# EAGLE board PCB-TLY-JACK-MEGA (EAGLE 6.5.0)
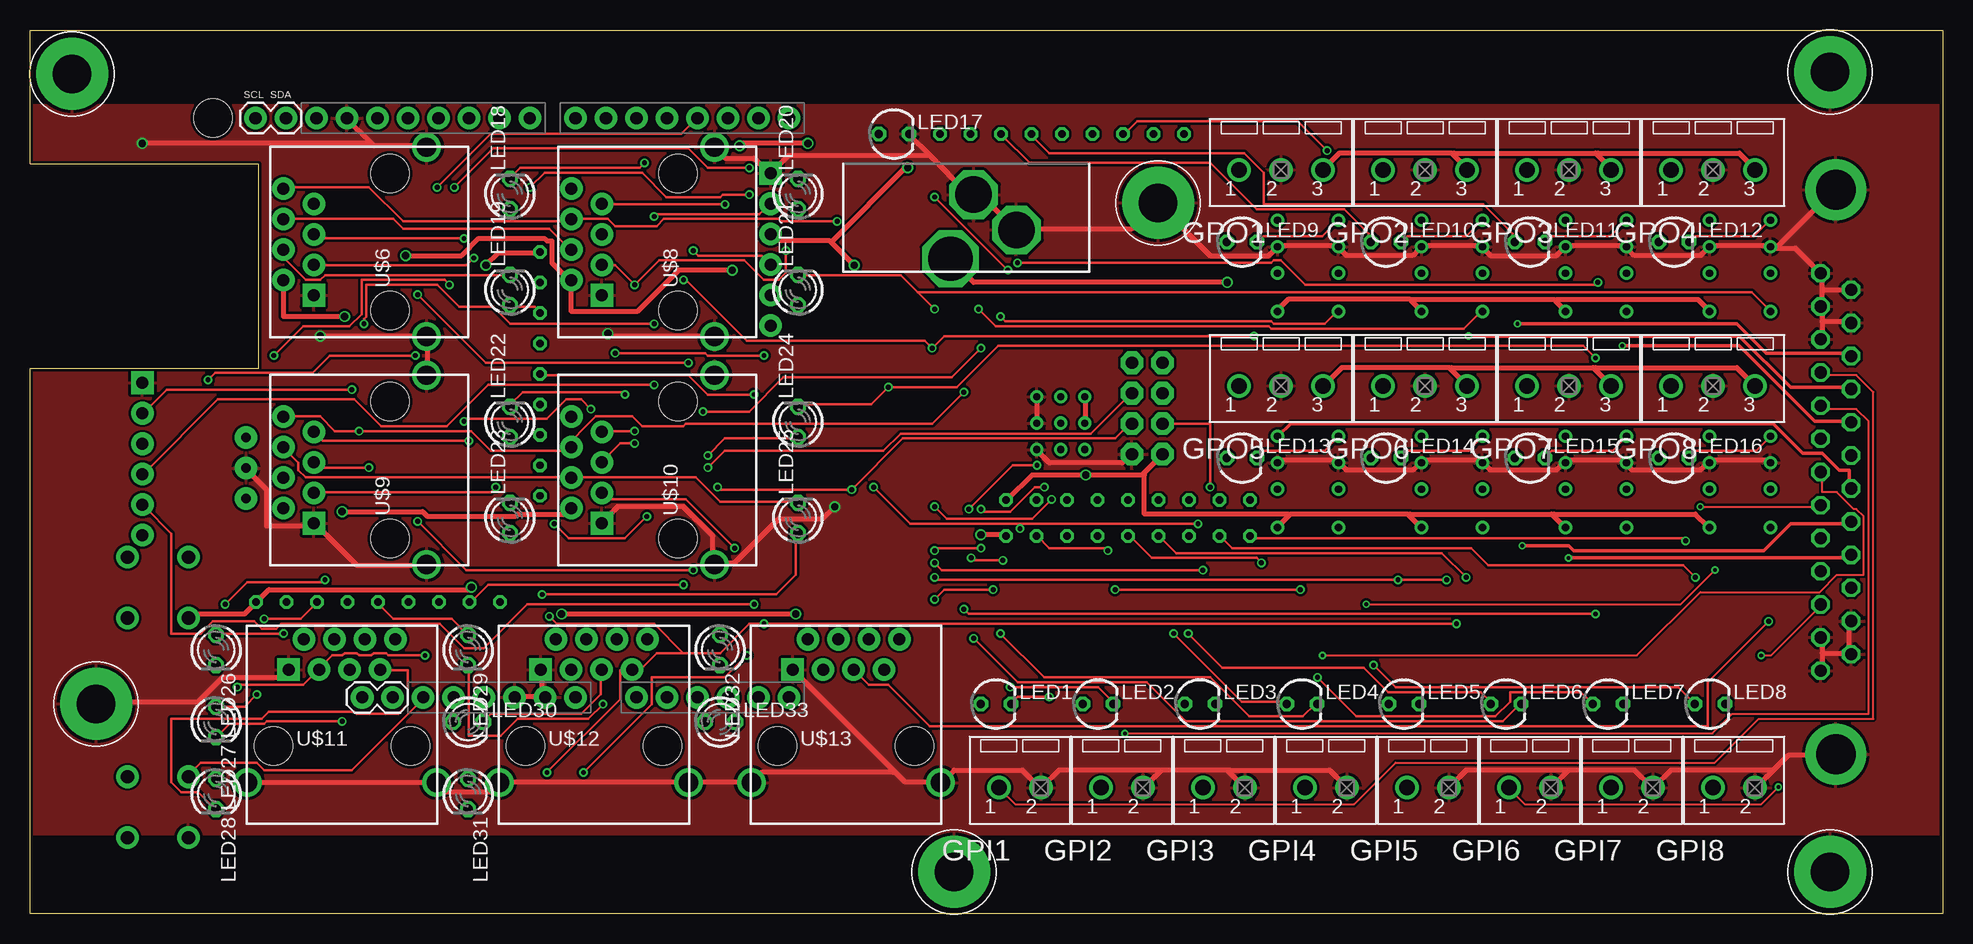
[diagram p2: board, top side]
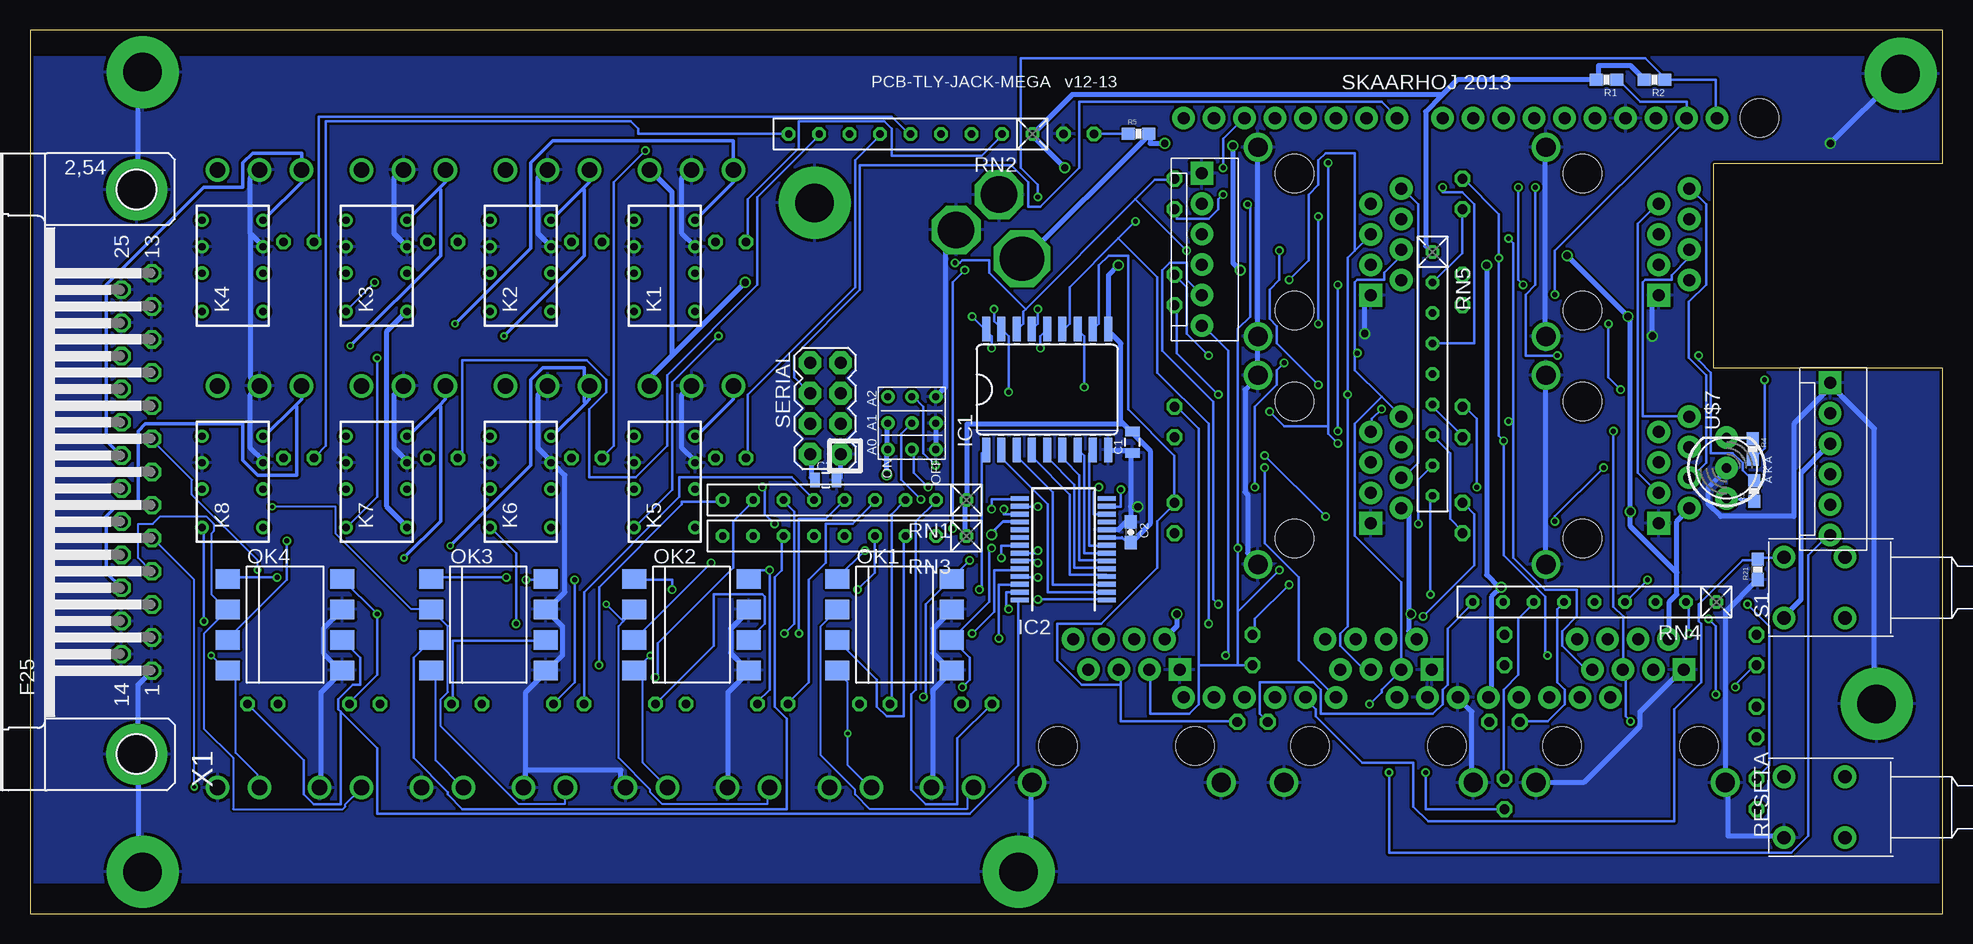
[diagram p3: board, bottom side, seen from below]

Size 159.38 x 73.66 mm. Coordinates in mm from the lower left corner, seen from the top.
Outline: 0,0 0,45.47 19.05,45.47 19.05,62.5 0,62.5 0,73.66 159.38,73.66 159.38,0 0,0
Copper layers (1*16): Top 0.035mm / dielectric 1.5mm / Bottom 0.035mm
Design rules "Fusion_eagle_rule_v1.1": minimum track width 6mil, minimum drill 12mil, track to track 6mil, track to pad 6mil, pad to pad 6mil, via to via 6mil, smd to smd 0mil, copper to edge 10mil, drill to drill 10mil, minimum pad ring 10mil, minimum via ring 6mil, stop-mask expansion 2mil, vias tented up to drill 100mil, thermal gap 10mil
Net classes: 0 default: width 0.203 mm, drill 0.406 mm, clearance 0.203 mm; 1 PWR: width 0.406 mm, drill 0.61 mm, clearance 0.203 mm; 2 RELAY LINES: width 0.305 mm, clearance 0.203 mm; 3 INput lines: clearance 0.203 mm
Holes 3.2 mm at 15.24,66.31
tRestrict: area 0,0 to 160,6.5; area 0,67.5 to 160,74
bRestrict: area 0,71.5 to 160,74; area 0,0 to 160,2.5

## Footprints (pad centres in the part's own frame; a part is rotated, then mirrored left to right if it is on the bottom)
0805 = smd 0.8 x 1.2: 1 -0.9,0; 2 0.9,0
0603-CAP = smd 1.1 x 1: 1 -0.85,0; 2 0.85,0
DUEMILANOVE_VIAS = drill 1.016 pad 1.88: 3.3V 50.8,13.97; 5V 50.8,16.51; A0 50.8,29.21; A1 50.8,31.75; A2 50.8,34.29; A3 50.8,36.83; A4 50.8,39.37; A5 50.8,41.91; AREF 2.54,2.54; D2 2.54,36.83; D3 2.54,34.29; D4 2.54,31.75; D5 2.54,29.21; D6 2.54,26.67; D7 2.54,24.13; D8 2.54,20.32; D9 2.54,17.78; D10 2.54,15.24; D11 2.54,12.7; D12 2.54,10.16; D13 2.54,7.62; GND@0 50.8,19.05; GND@1 50.8,21.59; GND@2 2.54,5.08; RES 50.8,11.43; RX 2.54,41.91; TX 2.54,39.37; VIN 50.8,24.13
MSTBV2-3.5 = drill 1.3: 1 -1.75,0.02; 2 1.75,0.02
MSTBV3-3.5 = drill 1.3: 1 -3.5,0; 2 0,0; 3 3.5,0
SO18W = smd 0.66 x 2.032: 1 -5.08,-5.029; 2 -3.81,-5.029; 3 -2.54,-5.029; 4 -1.27,-5.029; 5 0,-5.029; 6 1.27,-5.029; 7 2.54,-5.029; 8 3.81,-5.029; 9 5.08,-5.029; 10 5.08,5.029; 11 3.81,5.029; 12 2.54,5.029; 13 1.27,5.029; 14 0,5.029; 15 -1.27,5.029; 16 -2.54,5.029; 17 -3.81,5.029; 18 -5.08,5.029
SSOP28 = smd 0.4 x 1.5: 1 -4.225,-3.625; 2 -3.575,-3.625; 3 -2.925,-3.625; 4 -2.275,-3.625; 5 -1.625,-3.625; 6 -0.975,-3.625; 7 -0.325,-3.625; 8 0.325,-3.625; 9 0.975,-3.625; 10 1.625,-3.625; 11 2.275,-3.625; 12 2.925,-3.625; 13 3.575,-3.625; 14 4.225,-3.625; 15 4.225,3.625; 16 3.575,3.625; 17 2.925,3.625; 18 2.275,3.625; 19 1.625,3.625; 20 0.975,3.625; 21 0.325,3.625; 22 -0.325,3.625; 23 -0.975,3.625; 24 -1.625,3.625; 25 -2.275,3.625; 26 -2.925,3.625; 27 -3.575,3.625; 28 -4.225,3.625
1X02 = drill 1.016 pad 1.88: 1 0,0; 2 2.54,0
MOLEX-1X6 = drill 1.016 pad 1.88 square: 1 0,0 | drill 1.016 pad 1.88: 2 2.54,0; 3 5.08,0; 4 7.62,0; 5 10.16,0; 6 12.7,0
DS2Y = drill 0.6: 1 1.2,0.46; 16 1.2,5.54; O1 4.4,0.46; O2 4.4,5.54; P1 6.6,0.46; P2 6.6,5.54; S1 8.8,0.46; S2 8.8,5.54
LED3MM = drill 0.7 pad 1.2 octagon: A -1.27,0; K 1.27,0
LED3MM' = drill 0.813 octagon: A -1.27,0; K 1.27,0
DIL8-SMD = smd 1.6 x 2: 1 -3.81,-4.77; 2 -1.27,-4.77; 3 1.27,-4.77; 4 3.81,-4.77; 5 3.81,4.77; 6 1.27,4.77; 7 -1.27,4.77; 8 -3.81,4.77
0603-RES = smd 1.1 x 1: 1 -0.85,0; 2 0.85,0
PUSHBUTTON = drill 1.1 pad 1.88: 1 2.54,2.54; 2 2.54,-2.54; 3 -2.54,2.54; 4 -2.54,-2.54
RN-9 = drill 0.6 octagon: 1 -10.16,0; 2 -7.62,0; 3 -5.08,0; 4 -2.54,0; 5 0,0; 6 2.54,0; 7 5.08,0; 8 7.62,0; 9 10.16,0
2X4 = drill 1.016 pad 1.88 octagon: 1 -3.81,-1.27; 2 -3.81,1.27; 3 -1.27,-1.27; 4 -1.27,1.27; 5 1.27,-1.27; 6 1.27,1.27; 7 3.81,-1.27; 8 3.81,1.27
3.2MMPAD6MM = drill 3.2 pad 6: P$1 0,0
POWER_JACK_PTH_UPRIGHT = drill 3.048 octagon: GND -1,-4.2; SHUNT 1.935,-0.63 | drill 3.7 octagon: PWR -3.4,1.3
RJ45-8_GND_UPRIGHT = drill 1 pad 1.88 square: 1 -4.445,6.35 | drill 1 pad 1.88: 2 -3.175,8.89; 3 -1.905,6.35; 4 -0.635,8.89; 5 0.635,6.35; 6 1.905,8.89; 7 3.175,6.35; 8 4.445,8.89 | drill 1.6: GND -7.88,-3.05; GND1 7.88,-3.05 | hole 3.2: -5.715,0; 5.715,0
LED5MM-BICOLOR = drill 0.813 pad 1.88: A2 2.54,0; A3 -2.54,0; K1 0,0
3BITADDR = drill 0.6: A0 -2.2,0; A1 0,0; A2 2.2,0; H1 -2.2,2; H2 0,2; H3 2.2,2; L1 -2.2,-2; L2 0,-2; L3 2.2,-2
F25HP = drill 1.016 octagon: 1 -16.561,-1.27; 2 -13.792,-1.27; 3 -11.049,-1.27; 4 -8.28,-1.27; 5 -5.512,-1.27; 6 -2.769,-1.27; 7 0,-1.27; 8 2.769,-1.27; 9 5.512,-1.27; 10 8.28,-1.27; 11 11.049,-1.27; 12 13.792,-1.27; 13 16.561,-1.27; 14 -15.189,1.27; 15 -12.421,1.27; 16 -9.652,1.27; 17 -6.909,1.27; 18 -4.14,1.27; 19 -1.372,1.27; 20 1.372,1.27; 21 4.14,1.27; 22 6.909,1.27; 23 9.652,1.27; 24 12.421,1.27; 25 15.189,1.27 | drill 3.302 pad 5.08: G1 -23.52,0; G2 23.52,0

## Placement (x,y rotation side)
C1  100nF  [0805]  67.52,39.31 90 bottom
C2  100nF  [0603-CAP]  67.65,31.81 270 bottom
C3  10uF  [0805]  93.07,36.16 0 bottom
GND  ARDUINO_SHIELDNO_SILK  [DUEMILANOVE_VIAS]  21.34,68.85 270 top
GPI1  MSTBV23.5MM  [MSTBV2-3.5]  82.5,10.5 0 top
GPI2  MSTBV23.5MM  [MSTBV2-3.5]  91,10.5 0 top
GPI3  MSTBV23.5MM  [MSTBV2-3.5]  99.5,10.5 0 top
GPI4  MSTBV23.5MM  [MSTBV2-3.5]  108,10.5 0 top
GPI5  MSTBV23.5MM  [MSTBV2-3.5]  116.5,10.5 0 top
GPI6  MSTBV23.5MM  [MSTBV2-3.5]  125,10.5 0 top
GPI7  MSTBV23.5MM  [MSTBV2-3.5]  133.5,10.5 0 top
GPI8  MSTBV23.5MM  [MSTBV2-3.5]  142,10.5 0 top
GPO1  CON1  [MSTBV3-3.5]  104.25,62 0 top
GPO2  CON1  [MSTBV3-3.5]  116.25,62 0 top
GPO3  CON1  [MSTBV3-3.5]  128.25,62 0 top
GPO4  CON1  [MSTBV3-3.5]  140.25,62 0 top
GPO5  CON1  [MSTBV3-3.5]  104.25,44 0 top
GPO6  CON1  [MSTBV3-3.5]  116.25,44 0 top
GPO7  CON1  [MSTBV3-3.5]  128.25,44 0 top
GPO8  CON1  [MSTBV3-3.5]  140.25,44 0 top
IC1  ULN2803A  [SO18W]  74.62,43.7 0 bottom
IC2  MCP23017SS  [SSOP28]  73.27,30.39 90 bottom
JP1  [1X02]  27.69,18.05 0 top
JP3  [MOLEX-1X6]  61.72,61.72 270 bottom
JP4  [1X02]  21.34,66.31 180 top
JP5  [MOLEX-1X6]  9.36,44.26 270 bottom
K1  RELAY5VIM03  [DS2Y]  103.5,49 90 bottom
K2  RELAY5VIM03  [DS2Y]  115.5,49 90 bottom
K3  RELAY5VIM03  [DS2Y]  127.5,49 90 bottom
K4  RELAY5VIM03  [DS2Y]  139.5,49 90 bottom
K5  RELAY5VIM03  [DS2Y]  103.5,31 90 bottom
K6  RELAY5VIM03  [DS2Y]  115.5,31 90 bottom
K7  RELAY5VIM03  [DS2Y]  127.5,31 90 bottom
K8  RELAY5VIM03  [DS2Y]  139.5,31 90 bottom
LED1  3mm LED  [LED3MM]  80.5,17.5 0 top
LED2  3mm LED  [LED3MM]  89,17.5 0 top
LED3  3mm LED  [LED3MM]  97.5,17.5 0 top
LED4  3mm LED  [LED3MM]  106,17.5 0 top
LED5  3mm LED  [LED3MM]  114.5,17.5 0 top
LED6  3mm LED  [LED3MM]  123,17.5 0 top
LED7  3mm LED  [LED3MM]  131.5,17.5 0 top
LED8  3mm LED  [LED3MM]  140,17.5 0 top
LED9  3mm LED  [LED3MM]  101,56 0 top
LED10  3mm LED  [LED3MM]  113,56 0 top
LED11  3mm LED  [LED3MM]  125,56 0 top
LED12  3mm LED  [LED3MM]  137,56 0 top
LED13  3mm LED  [LED3MM]  101,38 0 top
LED14  3mm LED  [LED3MM]  113,38 0 top
LED15  3mm LED  [LED3MM]  125,38 0 top
LED16  3mm LED  [LED3MM]  137,38 0 top
LED17  3mm LED  [LED3MM]  72,65 0 top
LED18  [LED3MM']  40,60 90 top
LED19  [LED3MM']  40,52 90 top
LED20  [LED3MM']  64,60 90 top
LED21  [LED3MM']  64,52 90 top
LED22  [LED3MM']  40,41 90 top
LED23  [LED3MM']  40,33 90 top
LED24  [LED3MM']  64,41 90 top
LED25  [LED3MM']  64,33 90 top
LED26  [LED3MM']  15.5,22 270 top
LED27  [LED3MM']  15.5,16 270 top
LED28  [LED3MM']  15.5,10 270 top
LED29  [LED3MM']  36.5,22 270 top
LED30  [LED3MM']  36.5,16 0 top
LED31  [LED3MM']  36.5,10 270 top
LED32  [LED3MM']  57.5,22 270 top
LED33  [LED3MM']  57.5,16 0 top
OK1  LTV826S  [DIL8-SMD]  87.33,24.1 270 bottom
OK2  LTV826S  [DIL8-SMD]  104.26,24.1 270 bottom
OK3  LTV826S  [DIL8-SMD]  121.19,24.1 270 bottom
OK4  LTV826S  [DIL8-SMD]  138.12,24.1 270 bottom
R1  1K5  [0603-RES]  28,69.5 180 bottom
R2  1K5  [0603-RES]  24,69.5 180 bottom
R3  270  [0603-RES]  15.71,35.24 90 bottom
R4  270  [0603-RES]  15.83,38.76 270 bottom
R5  [0603-RES]  67,65 0 bottom
R21  10K  [0603-RES]  15.41,28.72 90 bottom
RESETA  [PUSHBUTTON]  10.67,8.89 90 bottom
RN1  [RN-9]  91.5,34.5 180 bottom
RN2  [RN-9]  86,65 180 bottom
RN3  [RN-9]  91.5,31.5 180 bottom
RN4  [RN-9]  29,26 180 bottom
RN5  [RN-9]  42.5,45 270 bottom
S1  [PUSHBUTTON]  10.67,27.19 90 bottom
SERIAL  M04X2  [2X4]  93.1,42.12 90 bottom
U$4  GNDPAD6MM  [3.2MMPAD6MM]  94,59.25 0 top
U$5  POWER_JACKPTH_UPRIGHT  [POWER_JACK_PTH_UPRIGHT]  78,58 90 top
U$6  Tally 1-2-3  [RJ45-8_GND_UPRIGHT]  30,56 90 top
U$7  LEDBICOLOR-AKA  [LED5MM-BICOLOR]  18,37.16 90 bottom
U$8  Tally 2-3-4  [RJ45-8_GND_UPRIGHT]  54,56 90 top
U$9  Tally 3-4-1  [RJ45-8_GND_UPRIGHT]  30,37 90 top
U$10  Tally 4-1-2  [RJ45-8_GND_UPRIGHT]  54,37 90 top
U$11  Tally 1-2-3  [RJ45-8_GND_UPRIGHT]  26,14 0 top
U$12  Tally 2-3-4  [RJ45-8_GND_UPRIGHT]  47,14 0 top
U$13  Tally 3-4-1  [RJ45-8_GND_UPRIGHT]  68,14 0 top
U$15  GNDPAD6MM  [3.2MMPAD6MM]  150,3.5 0 top
U$18  GNDPAD6MM  [3.2MMPAD6MM]  150,70.16 0 top
U$19  3BITADDR  [3BITADDR]  85.89,40.9 90 bottom
U$20  GNDPAD6MM  [3.2MMPAD6MM]  5.5,17.5 0 top
U$21  GNDPAD6MM  [3.2MMPAD6MM]  3.5,70 0 top
U$23  GNDPAD6MM  [3.2MMPAD6MM]  77,3.5 0 top
X1  DB25F  [F25HP]  150.49,36.83 90 bottom

## Tracks (layer width: path | path; a pad name or v marks a point on that pad's centre or on a via)
5V  (via drill 0.61)
  Top 0.406: 115.11,51.1 115.82,50.39 K2.1 | 115.11,51.1 115.01,51.21 104.85,51.21 104.04,50.39 K1.1 | 127.1,51.1 127,51.21 115.21,51.21 115.11,51.1 | 127.1,51.1 127.81,50.39 K3.1 | K4.1 139.8,50.39 138.99,51.21 127.2,51.21 127.1,51.1 | v68.68,54.05 66.75,55.98 | 66.75,55.98 66.65,56.08 62.18,56.08 61.77,56.49 JP3.3 | U$19.H3 87.99,43.08 87.99,41.05 U$19.H2 | 92.76,36.68 94.28,38.2 SERIAL.2 | 92.76,36.68 92.66,36.58 v87.99,36.58 83.52,36.58 81.48,34.54 RN1.1 | 104.95,33.22 105.05,33.33 114.81,33.33 114.91,33.22 | 104.95,33.22 104.04,32.31 K5.1 | 114.91,33.22 115.82,32.31 K6.1 | 126.9,33.22 126.8,33.33 115.01,33.33 114.91,33.22 | 126.9,33.22 127.81,32.31 K7.1 | K8.1 139.8,32.31 138.79,33.33 127,33.33 126.9,33.22 | 92.76,36.68 92.86,36.58 92.86,33.33 104.85,33.33 104.95,33.22 | S1.3 13.21,24.79 13.41,24.99 17.88,24.99 18.69,25.81 RN4.1 18.9,26.01 19.91,27.03 36.58,27.03 v36.78,27.23 | v38,54.05 39.01,55.07 42.47,55.07 RN5.1 | 66.75,55.98 72.95,62.18 v73.15,62.18 | v79.25,31.6 81.28,31.6 RN3.1
  Bottom 0.254: IC2.9 68.36,31.36 68,31 67.69,31 C2.2 | IC2.18 78.33,32.66 79,32 79,31.6 79,31.5
  Bottom 0.406: C2.2 67.46,31.09 66.04,32.51 66.04,38.61 67.46,40.03 C1.2 67.67,40.23 68.38,40.95 | 68.38,40.95 68.48,41.05 68.48,47.55 69.49,48.56 IC1.10 69.49,48.77 69.49,53.24 v68.68,54.05 | U$19.H2 87.99,40.84 87.99,38.81 U$19.H1 87.99,38.61 v87.99,36.58 | RN3.1 81.48,31.7 81.48,34.34 RN1.1 81.28,34.54 81.28,40.84 68.48,40.84 68.38,40.95 | C3.1 94.08,36.17 94.28,36.37 94.28,38.2 SERIAL.2 | K3.1 128.02,50.19 129.64,48.56 129.64,33.93 128.02,32.31 K7.1 | GND.5V 37.8,18.09 37.59,18.29 37.59,26.42 v36.78,27.23 36.98,27.23 38,28.25 v38,54.05 | JP5.3 9.55,39.01 11.79,36.78 11.79,26.21 13.21,24.79 S1.3 | R2.2 24.99,69.7 26.01,70.71 28.65,70.71 28.65,69.7 R1.2 40.44,69.49 41.76,68.17 | 41.76,68.17 43.08,66.85 43.08,55.68 42.67,55.27 RN5.1 | 41.76,68.17 41.86,68.28 72.54,68.28 75.79,65.02 RN2.1 75.79,64.82 v73.15,62.18 | v79.25,31.6 79,31.6
12V  (via drill 0.61)
  Top 0.406: v44.3,24.99 v63.8,24.99 | v26.21,49.78 21.13,49.78 21.13,52.63 U$6.2 | v31.29,54.86 35.97,54.86 37.39,56.29 42.88,56.29 43.08,56.08 43.48,56.08 43.48,54.25 44.91,52.83 U$8.2 45.11,52.63 45.11,50.19 50.6,50.19 54.05,53.65 v58.52,53.65 | v26.01,33.53 32.72,33.53 33.12,33.12 40.44,33.12 40.64,33.33 44.5,33.33 44.91,33.73 U$10.2 | 118.57,63.3 119.69,62.18 GPO2.3 | 118.57,63.3 118.47,63.4 109.12,63.4 107.9,62.18 GPO1.3 | 130.56,63.3 130.45,63.4 118.67,63.4 118.57,63.3 | 130.56,63.3 131.67,62.18 GPO3.3 | GPO4.3 143.66,62.18 142.44,63.4 130.66,63.4 130.56,63.3 | 118.36,45.41 119.69,44.09 GPO6.3 | 118.36,45.41 118.26,45.52 109.32,45.52 107.9,44.09 GPO5.3 | 130.35,45.41 130.25,45.52 118.47,45.52 118.36,45.41 | 130.35,45.41 131.67,44.09 GPO7.3 | GPO8.3 143.66,44.09 142.24,45.52 130.45,45.52 130.35,45.41 | v99.77,52.63 78.64,52.63 76.81,54.46 U$5.PWR | v59.13,64.01 59.33,64.21 v64.82,64.21
  Bottom 0.406: 44.5,24.99 44.5,33.33 44.91,33.73 U$10.2 | 44.5,24.99 44.5,23.57 43.89,22.96 U$12.2 | v63.8,24.99 63.8,23.98 64.82,22.96 U$13.2 | 44.5,24.99 v44.3,24.99 | 22.15,28.45 22.15,26.62 22.76,26.01 22.76,22.96 U$11.2 | 22.15,28.45 22.15,32.72 21.13,33.73 U$9.2 | 22.15,28.45 26.01,32.31 v26.01,33.53 26.01,49.58 v26.21,49.78 v31.29,54.86 | U$5.PWR 76.61,54.46 66.24,64.82 R5.2 66.04,64.82 66.04,64.21 v64.82,64.21 | 105.77,46.63 107.7,44.7 107.7,44.09 GPO5.3 | 105.77,46.63 v99.77,52.63 | GPO1.3 107.7,61.98 105.87,60.15 105.87,46.74 105.77,46.63 | v58.52,53.65 59.13,54.25 v59.13,64.01
A0  (via drill 0.41)
  Top 0.203: v79.25,33.73 79.45,33.53 81.69,33.53 83.72,35.56 v84.53,35.56
  Bottom 0.203: v79.25,33.73 79.25,34.54 77.01,34.54 IC2.15 | v84.53,35.56 85.75,36.78 85.75,38.61 U$19.A0
A1  (via drill 0.41)
  Top 0.203: v75.39,33.93 76.4,32.92 83.52,32.92 v85.14,34.54
  Bottom 0.203: v75.39,33.93 76.81,33.93 IC2.16 | v85.14,34.54 86.77,36.17 86.77,40.03 85.95,40.84 U$19.A1
A1CFG
  Bottom 0.203: S1.1 13.21,29.67 15.24,29.67 R21.2 15.44,29.46 16.66,29.46 20.32,25.81 20.32,24.38 20.12,24.18 20.12,19.3 22.35,17.07 22.35,7.72 42.88,7.72 44.09,8.94 44.09,12.6 48.36,12.6 52.22,16.46 52.22,17.07 53.03,17.88 GND.A1
A2  (via drill 0.41)
  Top 0.203: v78.23,33.73 81.89,37.39 v83.92,37.39
  Bottom 0.203: v78.23,33.73 78.23,33.33 77.01,33.33 IC2.17 | v83.92,37.39 84.94,38.41 84.94,42.27 85.75,43.08 U$19.A2
D2  (via drill 0.41)
  Top 0.203: v20.32,46.53 22.76,48.97 26.62,48.97 27.64,49.99 27.64,52.83 34.54,52.83 v34.95,52.43 | v35.36,60.55 38.61,63.8 54.86,63.8 56.49,62.18 v59.94,62.18
  Bottom 0.203: v20.32,46.53 20.32,46.13 19.3,45.11 19.3,38.41 17.48,38.41 16.66,37.59 16.66,36.98 15.85,36.17 R3.2 | v34.95,52.43 35.36,52.83 v35.36,60.55 | v59.94,62.18 59.94,64.62 58.32,66.24 GND.D2
D3  (via drill 0.41)
  Top 0.203: v14.83,44.5 15.44,45.11 23.57,45.11 24.99,46.53 v32.11,46.53 | v33.93,60.55 38.41,65.02 54.25,65.02 55.47,66.24 GND.D3
  Bottom 0.203: v14.83,44.5 14.83,38.81 15.65,38 R4.2 | v32.11,46.53 34.75,46.53 34.75,51.61 33.93,52.43 v33.93,60.55
DISP_DATA_OUT
  Bottom 0.203: GND.D7 45.52,66.45 46.74,67.67 71.93,67.67 71.93,62.18 75.18,58.93 76.2,58.93 76.2,60.96 77.62,62.38 90.22,62.38 90.22,52.02 95.71,46.53 95.71,44.7 94.49,43.48 SERIAL.6
GND  (via drill 0.61)
  Top 0.406: K5.P1 104.04,37.8 108.92,37.8 K5.P2 109.12,37.59 109.73,36.98 115.21,36.98 115.82,37.59 K6.P1 116.03,37.8 120.9,37.8 K6.P2 121.11,37.59 121.72,36.98 127.2,36.98 127.81,37.59 K7.P1 128.02,37.8 132.89,37.8 K7.P2 133.1,37.39 133.5,36.98 139.19,36.98 139.8,37.59 K8.P1 140,37.8 144.88,37.8 K8.P2 | 149.35,49.38 149.35,50.6 X1.12 149.35,50.8 149.35,52.02 | 149.35,49.38 149.35,47.95 X1.11 | 149.35,52.02 149.35,53.24 X1.13 149.15,53.44 147.12,55.47 145.49,55.47 | 149.35,49.38 151.59,49.38 X1.24 | 149.35,52.02 X1.25 | K4.P2 144.88,55.68 140,55.68 K4.P1 139.8,55.47 139.19,54.86 133.71,54.86 133.1,55.47 K3.P2 132.89,55.68 128.02,55.68 K3.P1 127.81,55.47 127.2,54.86 121.72,54.86 121.11,55.47 K2.P2 120.9,55.68 116.03,55.68 K2.P1 115.82,55.47 115.21,54.86 109.73,54.86 109.12,55.47 K1.P2 108.92,55.68 104.04,55.68 K1.P1 103.83,55.47 103.23,54.86 98.35,54.86 94.08,59.13 U$4.P$1 93.88,59.13 91.85,57.1 82.3,57.1 U$5.GND 82.09,57.1 79.45,59.74 78.64,59.74 U$5.SHUNT 78.44,59.94 78.23,59.94 74.88,63.3 | 145.49,55.47 145.09,55.47 K4.P2 | 145.49,55.47 150.37,60.35 X1.G2 | 145.49,55.47 K4.P2 | U$19.L3 83.92,43.08 83.92,41.05 U$19.L2 | U$19.L1 83.92,38.61 84.94,37.59 91.03,37.59 91.64,38.2 SERIAL.1 | U$10.1 47.75,32.72 48.97,33.93 54.46,33.93 56.9,31.5 56.9,29.26 U$10.GND 57.1,29.26 58.73,29.26 62.38,32.92 66.04,32.92 v67.06,33.93 | v48.16,48.36 48.36,48.16 56.9,48.16 U$8.GND | U$8.GND1 57.1,63.8 57.91,62.99 60.35,62.99 61.57,61.77 JP3.1 63.2,63.2 74.78,63.2 74.88,63.3 | 74.88,63.3 73.36,64.82 LED17.K | U$7.K1 18.09,36.98 19.71,35.36 19.71,32.31 23.37,32.31 23.57,32.51 U$9.1 23.77,32.51 27.23,29.06 32.92,29.06 U$9.GND
  Top 0.406: 28.35,64.31 28.65,64.01 32.92,64.01 U$6.GND1 | 28.35,64.31 26.42,66.24 GND.GND@2 | v24.18,48.16 32.92,48.16 U$6.GND 33.12,47.95 33.12,44.91 U$9.GND1 | v9.35,64.21 28.25,64.21 28.35,64.31 | 128.12,11.89 128.22,11.99 133.71,11.99 135.13,10.57 GPI7.2 135.33,10.57 136.75,11.99 145.09,11.99 145.19,11.89 | 128.12,11.89 126.8,10.57 GPI6.2 | GPI5.2 118.26,10.57 119.69,11.99 128.02,11.99 128.12,11.89 | 149.35,21.74 149.35,22.96 X1.2 | 149.35,21.74 149.35,20.32 X1.1 | 149.35,21.74 151.59,21.74 X1.14 151.59,21.95 151.59,24.38 X1.15 | 145.19,11.89 146.51,13.21 150.37,13.21 X1.G1 | 145.19,11.89 143.87,10.57 GPI8.2 | U$11.1 21.54,20.32 20.93,19.71 16.05,19.71 14.02,17.68 5.69,17.68 U$20.P$1 | GND.GND@0 40.44,18.09 42.88,18.09 GND.GND@1 42.88,18.29 42.67,18.29 42.67,20.32 U$12.1 | U$11.GND 18.29,10.97 33.73,10.97 U$11.GND1 33.93,10.77 34.54,10.16 38.41,10.16 39.01,10.77 U$12.GND 39.22,10.97 54.86,10.97 U$12.GND1 55.07,10.97 59.94,10.97 U$13.GND 60.15,10.97 60.96,11.79 71.93,11.79 72.03,11.89 | 94.18,11.89 94.28,11.99 99.77,11.99 99.87,11.89 | 94.18,11.89 92.86,10.57 GPI2.2 | 99.87,11.89 101.19,10.57 GPI3.2 | GPI4.2 109.73,10.57 108.31,11.99 99.97,11.99 99.87,11.89 | 94.18,11.89 94.08,11.99 85.75,11.99 84.33,10.57 GPI1.2 84.12,10.57 82.7,11.99 77.01,11.99 76,10.97 U$13.GND1 75.79,10.97 72.95,10.97 72.03,11.89 | 72.03,11.89 63.6,20.32 U$13.1
  Bottom 0.406: GPO5.2 104.44,43.89 105.05,43.28 105.05,38.81 104.04,37.8 K5.P1 | GPO6.2 116.43,43.89 117.04,43.28 117.04,38.81 116.03,37.8 K6.P1 115.82,37.59 114.81,36.58 114.81,26.82 116.23,25.4 OK3.7 116.23,25.2 115.01,23.98 115.01,21.54 116.23,20.32 OK3.5 116.43,20.12 118.06,18.49 118.06,11.99 | GPO7.2 128.42,43.89 129.03,43.28 129.03,38.81 128.02,37.8 K7.P1 | K8.P1 140,37.8 141.02,38.81 141.02,43.28 140.41,43.89 GPO8.2 140.41,44.09 141.02,44.7 141.02,56.49 140.92,56.59 | GPO3.2 128.42,61.98 129.03,61.37 129.03,56.69 128.02,55.68 K3.P1 | GPO1.2 104.44,61.98 105.05,61.37 105.05,56.69 104.04,55.68 K1.P1 | GPO2.2 116.43,61.98 117.04,61.37 117.04,56.69 116.03,55.68 K2.P1 | 140.92,56.59 140,55.68 K4.P1 | 140.92,56.59 141.02,56.69 141.02,61.37 140.41,61.98 GPO4.2 | U$18.P$1 150.16,70.1 150.37,69.9 150.37,60.35 X1.G2 | U$19.L1 83.92,38.81 83.92,40.84 U$19.L2 | C3.2 92.05,36.17 91.85,36.37 91.85,38.2 SERIAL.1 | U$19.L3 83.72,43.28 83.11,43.89 83.11,56.08 82.3,56.9 U$5.GND | 67.67,33.93 67.67,38.41 C1.1 67.67,38.61 69.49,38.61 IC1.9 | 67.67,33.93 67.67,32.72 C2.1 67.87,32.72 67.97,32.72 68.68,32 69.6,32 IC2.10 | v67.06,33.93 67.67,33.93 | v48.16,48.36 48.16,51 47.75,51.41 U$8.1 | U$8.GND1 57.1,63.8 57.1,48.16 U$8.GND 57.1,47.95 57.1,44.91 U$10.GND1 57.1,44.7 58.12,43.69 58.12,35.15 57.91,34.95 57.91,30.07 57.1,29.26 U$10.GND | v24.18,48.16 24.18,51 23.77,51.41 U$6.1 | U$6.GND1 33.12,63.8 33.12,48.16 U$6.GND | U$9.GND 33.12,29.26 33.12,44.7 U$9.GND1 | v9.35,64.21 3.66,69.9 U$21.P$1 | 118.06,11.99 118.06,10.57 GPI5.2 | OK4.7 133.5,25.2 134.93,23.77 134.93,21.74 133.5,20.32 OK4.5 133.5,20.12 135.13,18.49 135.13,10.57 GPI7.2
  Bottom 0.406: X1.1 149.35,20.12 150.37,19.1 150.37,13.41 X1.G1 150.37,13.21 150.37,3.86 150.16,3.66 U$15.P$1 | U$20.P$1 5.69,17.68 5.69,40.44 9.35,44.09 JP5.1 9.35,43.89 12.39,40.84 12.39,33.12 18.49,33.12 19.51,34.14 19.51,35.56 18.09,36.98 U$7.K1 | GND.GND@0 40.23,17.88 39.22,16.87 39.22,10.97 U$12.GND | R21.1 15.44,27.84 18.09,25.2 18.09,10.97 U$11.GND 17.88,10.97 17.88,6.5 13.21,6.5 RESETA.3 | OK1.7 82.7,25.2 84.12,23.77 84.12,21.74 82.7,20.32 OK1.5 82.7,20.12 84.12,18.69 84.12,10.57 GPI1.2 | OK2.7 99.57,25.2 100.99,23.77 100.99,21.74 99.57,20.32 OK2.5 99.57,20.12 101.19,18.49 101.19,10.57 GPI3.2 | U$23.P$1 76.81,3.66 76,4.47 76,10.77 U$13.GND1 | U$11.1 21.74,20.32 25.2,16.87 25.2,15.65 29.87,10.97 33.73,10.97 U$11.GND1 | 118.06,11.99 110.13,11.99 110.13,10.77 109.93,10.57 GPI4.2
  pour Top: 0,0 159,0 159,73 0,73
  pour Bottom: 0,0 159,0 159,73 0,73
GPI1
  Top 0.152: X1.10 149.35,45.11 149.56,44.91 152.2,44.91 153.62,43.48 153.62,16.26 144.07,16.26 140.41,12.6 113.79,12.6 110.34,9.14 82.09,9.14 80.87,10.36 GPI1.1
  Bottom 0.152: OK1.2 92.25,25.2 93.47,23.98 93.47,13.21 90.63,10.36 90.63,9.96 89.41,8.74 81.28,8.74 81.28,9.96 80.87,10.36 GPI1.1
GPI2  (via drill 0.3)
  Top 0.152: v91.24,15.04 140.21,15.04 141.83,16.66 153.21,16.66 153.21,41.05 152.2,42.06 149.56,42.06 149.35,42.27 X1.9
  Bottom 0.152: OK1.4 92.05,20.12 91.24,19.3 v91.24,15.04 91.24,12.39 89.41,10.57 GPI2.1
GPI3  (via drill 0.3)
  Top 0.152: v140.41,28.65 137.57,25.81 v111.35,25.81
  Bottom 0.152: 109.93,24.38 110.34,23.98 110.34,13.01 107.7,10.36 107.7,10.16 106.68,9.14 97.94,9.14 97.94,10.36 GPI3.1 | 109.93,24.38 109.12,25.2 OK2.2 | v140.41,28.65 140.41,29.46 145.9,34.95 145.9,36.17 149.15,39.42 X1.8 | 109.93,24.38 v111.35,25.81
GPI4  (via drill 0.3)
  Top 0.152: v107.7,21.54 133.91,21.54 139.19,26.82 149.15,26.82 150.57,28.25 152.81,28.25 152.81,33.12 152.2,33.73 151.99,33.73 150.57,35.15 149.35,35.15 149.35,36.78 X1.7
  Bottom 0.152: GPI4.1 106.27,10.57 108.31,12.6 108.31,19.51 108.92,20.12 OK2.4 108.92,20.32 v107.7,21.54
GPI5  (via drill 0.3)
  Top 0.152: v139.19,33.93 149.15,33.93 X1.6
  Bottom 0.152: GPI5.1 114.81,10.36 114.81,9.14 118.67,9.14 125.17,15.65 125.17,17.88 124.56,18.49 124.56,23.98 125.78,25.2 OK3.2 125.98,25.4 127.61,25.4 133.91,31.7 133.91,33.93 v139.19,33.93
GPI6  (via drill 0.3)
  Top 0.152: v145.69,10.57 144.27,9.14 124.56,9.14 123.34,10.36 GPI6.1
  Bottom 0.152: OK3.4 125.78,20.12 125.58,19.91 125.58,12.8 123.34,10.57 GPI6.1 | v145.69,10.57 145.69,27.84 149.15,31.29 X1.5
GPI7
  Bottom 0.152: X1.4 149.35,28.65 150.37,29.67 150.37,32.51 149.15,32.51 148.54,33.12 144.68,33.12 144.07,32.51 144.07,31.9 144.27,31.7 144.27,26.62 143.05,25.4 OK4.2 143.05,25.2 144.88,23.37 144.88,15.44 142.44,13.01 142.44,8.74 133.3,8.74 133.1,8.94 133.1,9.14 131.88,10.36 GPI7.1
GPI8  (via drill 0.3)
  Top 0.152: v144.27,21.54 145.09,21.54 149.15,25.6 X1.3
  Bottom 0.152: GPI8.1 140.41,10.57 140.41,11.58 142.24,13.41 142.24,19.51 142.85,20.12 OK4.4 143.05,20.32 v144.27,21.54
GPO1  (via drill 0.3)
  Top 0.305: v123.95,49.17 142.24,49.17 144.68,46.74 151.38,46.74 151.59,46.53 X1.23
  Bottom 0.305: K1.S1 103.83,57.91 100.79,60.96 100.79,61.98 GPO1.1 100.79,62.18 100.79,64.41 115.82,64.41 117.65,62.59 117.65,55.47 v123.95,49.17
GPO2  (via drill 0.3)
  Top 0.305: v119.89,48.16 142.44,48.16 146.71,43.89 151.59,43.89 X1.22
  Bottom 0.305: 113.28,60.45 112.78,60.96 112.78,61.98 GPO2.1 | 113.28,60.45 115.82,57.91 K2.S1 | v119.89,48.16 113.18,54.86 113.18,60.35 113.28,60.45
GPO3  (via drill 0.3)
  Top 0.305: v132.69,47.35 142.44,47.35 148.74,41.05 151.59,41.05 X1.21
  Bottom 0.305: 125.27,60.45 124.77,60.96 124.77,61.98 GPO3.1 | 125.27,60.45 127.81,57.91 K3.S1 | v132.69,47.35 125.17,54.86 125.17,60.35 125.27,60.45
GPO4
  Bottom 0.305: K4.S1 139.8,57.91 136.75,60.96 136.75,61.98 GPO4.1 136.75,62.18 136.75,63.4 140.82,63.4 141.63,62.59 141.63,60.55 144.88,60.55 153.01,52.43 153.01,39.42 151.79,38.2 X1.20
GPO5
  Top 0.305: X1.19 151.59,35.56 151.59,36.98 150.77,36.98 149.35,38.41 147.73,38.41 145.29,40.84 105.05,40.84 104.04,39.83 K5.S1
  Bottom 0.305: K5.S1 103.83,39.83 100.79,42.88 100.79,43.89 GPO5.1
GPO6  (via drill 0.3)
  Top 0.305: v124.36,30.68 128.22,30.68 128.63,30.28 144.47,30.28 146.71,32.51 151.59,32.51 X1.18
  Bottom 0.305: 113.08,42.57 112.78,42.88 112.78,43.89 GPO6.1 | 113.08,42.57 115.82,39.83 K6.S1 | v124.36,30.68 117.65,37.39 117.65,44.5 116.64,45.52 113.18,45.52 113.18,42.67 113.08,42.57
GPO7  (via drill 0.3)
  Top 0.305: v128.22,29.67 151.38,29.67 151.59,29.87 X1.17
  Bottom 0.305: 125.27,42.37 124.77,42.88 124.77,43.89 GPO7.1 | 125.27,42.37 127.81,39.83 K7.S1 | v128.22,29.67 125.17,32.72 125.17,42.27 125.27,42.37
GPO8
  Bottom 0.305: 137.26,42.37 136.75,42.88 136.75,43.89 GPO8.1 | 137.26,42.37 139.8,39.83 K8.S1 | X1.16 151.79,27.23 153.01,28.45 153.01,33.12 151.79,34.34 150.37,34.34 150.37,40.23 149.76,40.84 141.63,40.84 141.63,37.8 140.41,36.58 137.16,36.58 137.16,42.27 137.26,42.37
GPOINSIDE1  (via drill 0.41)
  Top 0.203: v80.87,49.78 81.28,49.38 103.43,49.38 103.63,49.17 107.9,49.17 108.92,50.19 K1.16 | v17.27,18.9 17.48,19.1 22.76,19.1 23.98,20.32 U$11.3 24.18,20.52 25.2,21.54 26.01,21.54 26.21,21.74 27.23,21.74 27.43,21.54 28.45,21.54 28.65,21.74 29.67,21.74 29.87,21.54 v32.92,21.54 | v36.98,54.66 36.37,54.05 23.77,54.05 U$6.3 | v50.39,39.22 49.17,39.22 47.75,37.8 U$10.5 | v51.21,62.59 50.8,62.18 40.84,62.18 40.03,61.37 LED18.K | v36.58,39.42 24.38,39.42 23.77,40.03 U$9.7 | v79.25,47.14 76.81,44.7 62.79,44.7 59.94,41.86 v56.08,41.86
  Bottom 0.203: v80.87,49.78 79.86,48.77 IC1.18 79.65,48.56 79.25,48.16 v79.25,47.14 | v17.27,18.9 17.27,19.1 15.65,20.73 LED26.K | LED18.K 39.83,61.16 36.98,58.32 v36.98,54.66 36.98,39.83 v36.58,39.42 36.58,29.87 33.12,26.42 33.12,21.74 v32.92,21.54 | v50.39,39.22 51.21,40.03 51.21,40.64 | v51.21,62.59 51.21,40.64 | v56.08,41.86 54.86,40.64 51.21,40.64
GPOINSIDE2  (via drill 0.41)
  Top 0.203: v79.05,50.39 80.47,48.97 103.23,48.97 103.43,48.77 119.48,48.77 120.9,50.19 K2.16 | v26.01,16.05 19.71,16.05 19.51,15.85 16.66,15.85 15.65,14.83 LED27.K | LED19.K 39.83,53.24 24.59,53.24 24.18,52.83 22.96,52.83 21.13,54.66 21.13,55.27 U$6.4 | 44.3,38.61 38.41,38.61 36.78,40.23 v27.43,40.23 25.4,40.23 24.18,41.45 21.13,41.45 U$9.8 | 44.3,38.61 44.7,38.61 44.91,38.81 U$10.6 44.3,38.61 | v77.83,43.48 75.18,40.84 54.66,40.84 54.46,40.64 51,40.64 50.19,41.45 47.14,41.45 44.3,38.61
  Bottom 0.203: v79.05,50.39 79.05,49.38 78.44,48.77 IC1.17 78.23,48.56 77.83,48.16 v77.83,43.48 | v26.01,16.05 26.42,16.46 26.42,20.12 26.62,20.32 U$11.5 26.62,20.52 26.62,24.79 27.43,25.6 v27.43,40.23 | U$9.8 21.13,41.45 24.99,41.45 24.99,52.63 24.79,52.83 22.55,52.83 22.55,53.24 21.13,54.66 21.13,55.27 U$6.4
GPOINSIDE3  (via drill 0.41)
  Top 0.203: LED28.K 15.44,8.74 14.02,10.16 12.6,10.16 11.79,10.97 11.79,16.26 19.3,16.26 19.91,16.87 27.03,16.87 27.23,16.66 30.68,16.66 31.5,17.48 31.5,20.32 29.26,20.32 U$11.7 | v36.17,56.29 23.98,56.29 23.77,56.49 U$6.5 | v50.39,40.23 47.75,40.23 U$10.7 | U$8.3 47.75,54.05 48.77,54.05 v50.39,52.43 52.43,54.46 59.54,54.46 61.16,52.83 62.38,52.83 62.99,53.44 v62.99,55.27 | v130.66,52.63 130.45,52.43 106.27,52.43 104.24,54.46 103.63,54.46 103.43,54.25 v82.3,54.25 | v36.17,41.05 36.37,41.25 43.08,41.25 44.7,42.88 45.92,42.88 v46.74,42.06
  Bottom 0.203: v36.17,56.29 35.76,55.88 35.76,41.05 | 35.76,41.05 35.76,29.67 33.12,27.03 30.48,27.03 30.48,24.79 31.7,23.57 31.7,22.35 29.87,20.52 29.26,20.52 U$11.7 | v50.39,52.43 v50.39,40.23 | 67.26,59.54 65.63,61.16 64.01,61.16 LED20.K | 67.26,59.54 76.4,50.39 | 76.4,50.39 76.61,50.19 76.61,49.17 77.01,48.77 IC1.16 | v130.66,52.63 132.89,50.39 K3.16 | v82.3,54.25 81.89,54.25 81.69,54.46 79.45,54.46 79.45,53.44 76.4,50.39 | 67.26,59.54 v62.99,55.27 | v36.17,41.05 35.76,41.05 | v46.74,42.06 47.55,41.25 47.55,40.23 U$10.7
GPOINSIDE4  (via drill 0.41)
  Top 0.203: v47.75,17.48 46.53,16.26 40.64,16.26 39.22,14.83 36.58,14.83 36.58,20.73 LED29.K | U$6.6 21.13,57.91 30.28,57.91 31.09,57.1 43.28,57.1 44.91,55.47 U$8.4 | 73.97,51.82 72.54,53.24 64.01,53.24 LED21.K | 73.97,51.82 v75.39,50.39 | 73.97,51.82 143.46,51.82 144.88,50.39 K4.16 | v48.77,46.74 56.29,46.74 56.49,46.53 v61.16,46.53
  Bottom 0.203: v47.75,17.48 46.74,18.49 46.74,18.69 45.11,20.32 U$12.3 45.11,20.52 45.11,27.64 48.97,31.5 48.97,40.84 46.74,43.08 | 46.74,43.08 48.97,45.31 48.97,46.74 | 46.74,43.08 U$10.8 | 48.97,46.74 48.97,52.63 48.77,52.83 46.53,52.83 46.53,53.44 45.11,54.86 45.11,55.27 U$8.4 | v75.39,50.39 75.39,49.17 75.79,48.77 IC1.15 | v48.77,46.74 48.97,46.74 | v61.16,46.53 62.99,48.36 62.99,52.22 63.8,53.03 63.8,53.24 LED21.K
GPOINSIDE5  (via drill 0.41)
  Top 0.203: v102.01,48.16 76.2,48.16 v75.18,47.14 74.57,47.75 59.74,47.75 54.66,52.83 v54.46,52.83 | v38.81,35.56 38.41,35.15 23.77,35.15 U$9.3 | LED30.K 37.8,16.05 38.41,16.66 45.92,16.66 47.55,18.29 47.55,20.32 U$12.5 | v49.58,43.28 49.38,43.48 41.05,43.48 40.03,42.47 LED22.K
  Bottom 0.203: v75.18,47.14 75.18,48.16 74.78,48.56 IC1.14 | v102.01,48.16 105.87,44.3 105.87,35.36 108.92,32.31 K5.16 | v38.81,35.56 38.81,41.25 39.83,42.27 LED22.K | U$6.7 23.77,59.13 25.4,57.51 25.4,36.78 23.77,35.15 U$9.3 | 48.97,55.27 49.58,54.66 v49.58,43.28 49.58,23.98 50.19,23.37 50.19,22.35 48.36,20.52 47.75,20.52 U$12.5 | 48.97,55.27 47.75,56.49 U$8.5 | v54.46,52.83 52.83,54.46 52.83,59.94 52.02,60.76 52.02,62.79 51.41,63.4 48.97,63.4 48.97,55.27
GPOINSIDE6  (via drill 0.41)
  Top 0.203: v67.26,57.71 62.59,57.71 62.38,57.91 52.83,57.91 52.22,57.3 48.77,57.3 48.16,57.91 U$8.6 44.91,57.71 31.09,57.71 28.25,60.55 21.13,60.55 U$6.8 | v118.87,24.18 v61.16,24.18 59.94,24.18 57.51,21.74 54.46,21.74 | 54.46,21.74 52.22,21.74 51,20.52 50.19,20.52 U$12.7 49.99,20.32 49.17,20.32 49.17,17.88 v43.08,11.79 | v43.28,24.79 43.89,24.18 52.02,24.18 54.46,21.74
  Bottom 0.203: U$9.4 20.93,36.37 19.71,37.59 19.71,44.91 21.13,46.33 21.13,51 19.71,52.43 19.71,59.13 20.93,60.35 U$6.8 | v67.26,57.71 68.68,56.29 | 68.68,56.29 72.75,52.22 72.75,49.17 73.15,48.77 IC1.13 | v118.87,24.18 118.87,30.07 120.9,32.11 K6.16 | v43.08,11.79 43.08,8.74 36.58,8.74 LED31.K | v43.28,24.79 39.01,29.06 39.01,33.33 39.83,34.14 LED23.K | 68.68,56.29 65.43,53.03 65.43,45.11 61.16,40.84 v61.16,24.18
GPOINSIDE7  (via drill 0.41)
  Top 0.203: LED24.K 64.01,42.47 70.1,42.47 v71.53,43.89 77.22,43.89 80.67,47.35 129.44,47.35 v130.45,46.33 | v58.73,30.48 54.66,34.54 48.16,34.54 47.75,34.95 U$10.3 | v28.25,37.19 24.18,37.19 23.77,37.59 U$9.5 | v32.31,32.72 36.37,28.65 v55.27,28.65 | v57.91,59.13 47.75,59.13 U$8.7
  Bottom 0.203: v71.53,43.89 71.53,48.16 71.93,48.56 IC1.12 | v130.45,46.33 130.45,34.75 132.89,32.31 K7.16 | 61.98,20.73 58.73,20.73 | 58.73,20.73 LED32.K | 61.98,20.73 61.98,17.48 62.79,16.66 66.04,16.66 66.04,20.32 U$13.3 | 58.73,20.73 58.73,25.2 | 58.73,25.2 v58.73,30.48 58.73,48.77 57.71,49.78 57.71,58.93 v57.91,59.13 | v28.25,37.19 32.31,33.12 v32.31,32.72 | 58.73,25.2 v55.27,28.65 | 61.98,20.73 61.98,40.44 63.8,42.27 LED24.K
GPOINSIDE8  (via drill 0.41)
  Top 0.203: LED25.K 63.8,34.34 57.51,34.34 55.47,36.37 U$10.4 44.91,36.37 22.96,36.37 22.35,36.98 22.35,37.59 21.13,38.81 U$9.6 | v144.88,24.38 139.8,19.3 139.8,15.65 74.98,15.65 71.53,19.1 69.9,19.1 68.68,20.32 U$13.5
  Bottom 0.203: IC1.11 70.71,48.77 70.31,49.17 70.31,54.05 69.49,54.86 67.87,54.86 67.87,42.06 64.01,38.2 64.01,34.34 LED25.K 64.01,34.14 65.43,32.72 65.43,28.85 70.1,24.18 73.76,24.18 73.76,21.13 71.73,19.1 68.48,19.1 | U$8.8 44.91,60.35 43.69,59.13 43.69,37.59 44.91,36.37 U$10.4 | v144.88,24.38 144.88,32.11 K8.16 | 68.48,19.1 68.48,20.32 U$13.5 | 68.48,19.1 68.48,16.05 58.93,16.05 LED33.K
I2C_SCL  (via drill 0.41)
  Top 0.203: v70.31,35.56 73.36,32.51 82.5,32.51 | v97.33,32.51 82.5,32.51 | v98.35,35.56 98.35,40.84 94.49,40.84 SERIAL.4 | v81.48,53.65 v75.39,59.74 | 82.5,32.51 v82.5,32.11
  Bottom 0.203: JP4.2 18.9,66.45 18.9,69.49 22.96,69.49 R2.1 23.16,69.7 24.79,71.32 76.81,71.32 76.81,62.18 75.39,60.76 v75.39,59.74 | v70.31,35.56 70.71,35.15 70.71,33.33 69.7,33.33 IC2.12 | v97.33,32.51 98.15,33.33 98.15,35.36 v98.35,35.56 | v81.48,53.65 82.5,52.63 v82.5,32.11
I2C_SDA  (via drill 0.41)
  Top 0.203: SERIAL.3 91.64,40.84 90.42,39.62 72.75,39.62 v68.48,35.36 57.51,35.36 v57.3,35.56 | v32.31,51.61 38,45.92 v54.86,45.92
  Bottom 0.203: R1.1 27.03,69.49 25.2,67.67 21.34,67.67 JP4.1 21.34,66.24 32.31,55.27 v32.31,51.61 | v68.48,35.36 68.48,33.93 69.49,33.93 IC2.13 | v54.86,45.92 55.47,45.31 55.47,44.09 57.3,42.27 v57.3,35.56
IN1  (via drill 0.41)
  Top 0.203: v78.44,29.67 78.64,29.46 v81.08,29.46 | v84.94,18.09 82.3,18.09 81.89,17.68 LED1.K
  Bottom 0.203: v78.44,29.67 78.44,30.68 77.01,30.68 IC2.21 | v81.08,29.46 82.5,28.04 OK1.8 82.7,27.84 84.73,25.81 84.73,18.29 v84.94,18.09
IN2  (via drill 0.41)
  Top 0.203: v75.39,30.28 75.59,30.48 v79.25,30.48 | v81.69,18.9 89,18.9 90.22,17.68 LED2.K
  Bottom 0.203: v75.39,30.28 75.39,30.07 76.81,30.07 IC2.22 | v79.25,30.48 79.45,30.28 79.45,26.01 82.5,22.96 OK1.6 82.5,22.76 81.08,21.34 81.08,19.51 v81.69,18.9
IN3  (via drill 0.41)
  Top 0.203: v75.39,29.26 76,28.65 v97.74,28.65
  Bottom 0.203: v75.39,29.26 75.39,29.46 76.81,29.46 IC2.23 | OK2.8 99.36,28.04 99.36,28.65 v97.74,28.65 97.74,18.69 98.75,17.68 LED3.K
IN4  (via drill 0.41)
  Top 0.203: v80.87,23.37 84.53,19.71 98.35,19.71 101.6,16.46 106.07,16.46 107.09,17.48 LED4.K
  Bottom 0.203: v80.87,23.37 79.05,25.2 79.05,28.65 77.01,28.65 IC2.24 | OK2.6 99.36,22.96 98.15,24.18 98.15,26.42 98.35,26.62 102.41,26.62 102.41,22.35 107.09,17.68 LED4.K
IN5  (via drill 0.41)
  Top 0.203: v75.39,28.04 75.59,27.84 v114,27.84 v118.06,27.84
  Bottom 0.203: v75.39,28.04 76.81,28.04 IC2.25 | v118.06,27.84 116.43,27.84 OK3.8 | v114,27.84 114,19.3 115.62,17.68 LED5.K
IN6  (via drill 0.41)
  Top 0.203: v78.64,22.96 82.3,19.3 93.07,19.3 96.32,16.05 122.73,16.05 124.16,17.48 LED6.K
  Bottom 0.203: v78.64,22.96 78.64,27.43 77.01,27.43 IC2.26 | OK3.6 116.43,22.76 124.16,22.76 124.16,17.68 LED6.K
IN7  (via drill 0.41)
  Top 0.203: v77.83,25.4 78.23,24.99 v130.45,24.99
  Bottom 0.203: v77.83,25.4 78.03,25.6 78.03,26.82 77.01,26.82 IC2.27 | OK4.8 133.3,27.84 v130.45,24.99 130.45,19.91 132.69,17.68 LED7.K
IN8
  Bottom 0.203: 133.5,16.87 133.71,17.07 133.71,17.88 132.49,19.1 131.88,19.1 131.88,21.34 133.3,22.76 OK4.6 | 133.5,16.87 130.45,13.82 130.45,8.33 81.08,8.33 77.01,12.39 77.01,26.01 IC2.28 | 133.5,16.87 133.5,9.14 135.74,9.14 136.55,9.96 136.55,12.8 141.22,17.48 LED8.K
N$1
  Bottom 0.203: RN1.2 83.92,34.34 85.55,32.72 85.55,18.69 85.95,18.29 85.95,10.36 84.73,9.14 82.09,9.14 82.09,14.63 79.25,17.48 LED1.A
N$2
  Bottom 0.203: RN1.3 86.56,34.34 87.58,33.33 87.58,17.68 LED2.A
N$3  (via drill 0.41)
  Top 0.203: v52.02,44.09 38.2,44.09 34.75,40.64 29.26,40.64 27.03,42.88 15.65,42.88 9.55,36.78 JP5.4 | v55.27,55.27 55.68,54.86 60.96,54.86 JP3.4
  Bottom 0.203: v52.02,44.09 55.47,47.55 55.47,48.97 56.08,49.58 56.08,52.02 55.27,52.83 v55.27,55.27
N$4
  Bottom 0.203: RN5.2 42.47,52.63 40.03,55.07 40.03,58.73 LED18.A
N$5  (via drill 0.41)
  Top 0.203: v75.39,26.21 76.2,27.03 v80.26,27.03
  Bottom 0.203: v75.39,26.21 69.7,26.21 IC2.1 | v80.26,27.03 80.06,27.23 80.06,38.41 79.86,38.61 IC1.1
N$6
  Bottom 0.203: RN1.4 89,34.34 90.83,32.51 93.07,32.51 93.07,29.26 94.49,27.84 94.49,19.3 96.11,17.68 LED3.A
N$7
  Bottom 0.203: R4.1 15.85,39.62 17.88,39.62 U$7.A2
N$8  (via drill 0.41)
  Top 0.203: v60.35,25.81 41.45,25.81 37.8,22.15 36.17,22.15 34.14,24.18 20.93,24.18 20.52,23.77 19.3,23.77 18.69,24.38 15.24,24.38 14.22,23.37 11.79,23.37 11.79,31.7 9.55,33.93 JP5.5
  Bottom 0.203: v60.35,25.81 60.76,26.21 60.76,42.67 65.02,46.94 65.02,53.65 64.41,54.25 62.99,54.25 62.99,52.83 JP3.5
N$9
  Top 0.203: RN5.3 42.47,50.19 42.06,50.6 40.03,50.6 LED19.A
N$10  (via drill 0.41)
  Top 0.203: v95.3,23.37 100.99,17.68 104.65,17.68 LED4.A
  Bottom 0.203: v95.3,23.37 95.3,32.92 93.07,32.92 91.64,34.34 RN1.5
N$11
  Bottom 0.203: R3.1 15.85,34.54 17.88,34.54 U$7.A3
N$12  (via drill 0.41)
  Top 0.203: v26.82,43.69 11.38,43.69 9.55,41.86 JP5.2 | v27.84,49.17 27.84,49.58 28.04,49.78 28.04,52.43 33.93,52.43 35.76,50.6 38.61,50.6 40.03,49.17 v52.02,49.17 | v52.02,58.12 52.22,58.32 60.76,58.32 61.57,59.13 JP3.2
  Bottom 0.203: v26.82,43.69 27.84,44.7 v27.84,49.17 | v52.02,58.12 v52.02,49.17
N$13  (via drill 0.41)
  Top 0.203: v41.66,60.55 42.88,61.77 51,61.77 53.03,59.74 57.51,59.74 57.71,59.94 v59.94,59.94
  Bottom 0.203: v41.66,60.55 41.66,60.15 40.03,60.15 39.01,59.13 39.01,47.55 42.47,47.55 RN5.4 | v59.94,59.94 60.35,59.54 60.35,58.73 61.16,57.91 63.8,57.91 63.8,58.73 LED20.A
N$14
  Bottom 0.203: RN1.6 94.08,34.54 95.91,36.37 105.26,36.37 105.26,34.75 113.18,26.82 113.18,17.68 LED5.A
N$15  (via drill 0.41)
  Top 0.203: v96.52,23.37 99.36,20.52 111.15,20.52 113.18,18.49 120.9,18.49 121.72,17.68 LED6.A
  Bottom 0.203: v96.52,23.37 95.71,24.18 95.71,33.53 96.52,34.34 RN1.7
N$16  (via drill 0.41)
  Top 0.203: v107.29,19.71 110.54,16.46 122.12,16.46 123.34,17.68 123.34,18.49 129.24,18.49 130.05,17.68 LED7.A
  Bottom 0.203: v107.29,19.71 107.09,19.91 107.09,22.55 100.79,28.85 100.79,32.72 99.16,34.34 RN1.8
N$17  (via drill 0.41)
  Top 0.203: v60.35,43.28 56.49,43.28 54.86,44.91 42.67,44.91 RN5.5
  Bottom 0.203: v60.35,43.28 63.8,46.74 63.8,50.6 LED21.A
N$18  (via drill 0.41)
  Top 0.203: v111.96,20.73 113.79,18.9 137.36,18.9 138.58,17.68 LED8.A
  Bottom 0.203: v111.96,20.73 111.96,27.23 105.05,34.14 105.05,34.34 101.8,34.34 RN1.9
N$19
  Bottom 0.203: RN2.2 78.44,64.82 80.06,63.2 87.58,63.2 87.58,65.43 88.19,66.04 95.3,66.04 95.3,63.8 99.57,59.54 99.57,56.08 LED9.A
N$20
  Top 0.203: RN2.3 81.08,64.82 83.31,62.59 98.35,62.59 102.21,58.73 109.53,58.73 111.56,56.69 111.56,56.08 LED10.A
N$21
  Bottom 0.203: RN5.6 42.47,42.27 40.03,39.83 LED22.A
N$22
  Top 0.203: RN2.4 83.52,64.82 84.94,63.4 101.19,63.4 102.82,61.77 102.82,59.13 121.11,59.13 123.55,56.69 123.55,56.08 LED11.A
N$23
  Bottom 0.203: RN2.5 86.16,65.02 87.58,66.45 135.33,66.45 135.33,56.29 135.53,56.08 LED12.A
N$24
  Bottom 0.203: RN2.6 88.59,64.82 90.63,62.79 90.63,52.22 99.57,43.28 99.57,38.2 LED13.A
N$25
  Bottom 0.203: RN5.7 42.47,39.83 41.05,38.41 41.05,32.92 40.03,31.9 LED23.A
N$26  (via drill 0.41)
  Top 0.203: v108.1,63.6 105.66,66.04 92.25,66.04 91.24,65.02 RN2.7
  Bottom 0.203: v108.1,63.6 110.74,60.96 110.74,39.01 111.56,38.2 LED14.A
N$27
  Bottom 0.203: RN2.8 93.67,64.82 98.75,59.74 98.75,52.43 106.27,44.91 106.27,39.01 108.92,36.37 112.78,36.37 112.78,42.06 111.35,43.48 111.35,44.5 112.98,46.13 123.34,46.13 123.34,38.41 123.55,38.2 LED15.A
N$28
  Bottom 0.203: RN2.9 96.32,65.02 108.71,65.02 108.71,65.43 109.32,66.04 134.72,66.04 134.72,39.01 135.53,38.2 LED16.A
N$29  (via drill 0.41)
  Top 0.203: v43.69,32.51 44.91,31.29 49.58,31.29 v51.41,33.12 | v56.49,38.2 57.91,39.62 63.8,39.62 LED24.A
  Bottom 0.203: v43.69,32.51 43.69,36.17 42.67,37.19 RN5.8 | v56.49,38.2 v51.41,33.12
N$30
  Bottom 0.203: R5.1 67.87,65.02 70.71,65.02 LED17.A
N$31  (via drill 0.41)
  Top 0.203: v42.67,26.62 62.18,26.62 63.8,28.25 63.8,31.7 LED25.A
  Bottom 0.203: v42.67,26.62 42.67,34.75 RN5.9
N$32  (via drill 0.41)
  Top 0.203: v21.13,23.37 15.65,23.37 LED26.A
  Bottom 0.203: v21.13,23.37 21.13,25.6 21.34,25.81 RN4.2
N$33  (via drill 0.41)
  Top 0.203: v19.51,24.59 22.55,24.59 23.77,25.81 RN4.3 | v18.9,18.29 17.88,17.27 15.65,17.27 LED27.A
  Bottom 0.203: v19.51,24.59 18.9,23.98 v18.9,18.29
N$34
  Bottom 0.203: IC2.2 69.7,26.82 74.57,26.82 74.57,34.14 78.23,37.8 78.23,38.61 IC1.2
N$35
  Bottom 0.203: IC2.3 69.7,27.43 74.17,27.43 74.17,35.15 77.01,38 77.01,38.61 IC1.3
N$36
  Bottom 0.203: IC2.4 69.7,28.25 72.75,28.25 72.75,34.95 75.79,38 75.79,38.61 IC1.4
N$37
  Bottom 0.203: IC2.5 69.7,28.85 72.34,28.85 72.34,35.76 74.57,38 74.57,38.61 IC1.5
N$38
  Bottom 0.203: IC2.6 69.7,29.46 71.93,29.46 71.93,36.58 73.15,37.8 73.15,38.61 IC1.6
N$39
  Bottom 0.203: IC2.7 69.7,30.07 71.53,30.07 71.53,38.2 71.93,38.61 IC1.7
N$40
  Bottom 0.203: IC2.8 69.7,30.68 71.12,30.68 71.12,38.41 70.92,38.61 IC1.8
N$41  (via drill 0.41)
  Top 0.203: v24.59,27.84 24.38,27.64 18.09,27.64 v16.26,25.81
  Bottom 0.203: v24.59,27.84 26.42,26.01 RN4.4 | v16.26,25.81 14.43,23.98 14.43,12.39 15.44,11.38 LED28.A
N$42
  Top 0.203: RN4.5 29.06,25.81 30.28,24.59 35.15,24.59 36.37,23.37 LED29.A
N$43
  Bottom 0.203: RN4.6 31.7,25.81 32.11,25.4 32.11,19.3 31.5,18.69 31.5,17.48 32.92,16.05 35.15,16.05 LED30.A
N$44
  Bottom 0.203: RN4.7 34.14,25.81 35.36,24.59 35.36,19.91 36.58,18.69 36.58,11.38 LED31.A
N$45  (via drill 0.41)
  Top 0.203: v46.13,11.79 51.82,17.48 51.82,19.71 57.91,19.71 v59.74,21.54
  Bottom 0.203: v46.13,11.79 46.13,5.08 12.6,5.08 11.18,6.5 11.18,29.87 9.55,31.5 JP5.6 | v59.74,21.54 59.54,21.74 59.54,46.94 61.57,48.97 JP3.6
N$46  (via drill 0.41)
  Top 0.203: v54.46,27.43 38.2,27.43 36.78,26.01 RN4.8
  Bottom 0.203: v54.46,27.43 57.3,24.59 57.3,23.37 LED32.A
N$47
  Bottom 0.203: RN4.9 39.22,25.81 41.25,23.77 41.25,19.1 41.66,18.69 41.66,17.48 42.47,16.66 51.82,16.66 51.82,18.69 52.43,19.3 56.9,19.3 56.9,16.66 56.29,16.05 LED33.A
N$48  (via drill 0.41)
  Top 0.203: v89.81,30.28 89.61,30.48 84.94,30.48 83.92,31.5 RN3.2
  Bottom 0.203: v89.81,30.28 92.05,28.04 OK1.1
N$49
  Bottom 0.203: OK1.3 92.05,22.76 88.8,19.51 88.8,17.27 87.99,16.46 86.56,16.46 86.56,31.5 RN3.3
N$50  (via drill 0.41)
  Top 0.203: v90.42,27.03 v105.87,27.03
  Bottom 0.203: v105.87,27.03 105.87,27.84 108.92,27.84 OK2.1 | v90.42,27.03 89,28.45 89,31.5 RN3.4
N$51  (via drill 0.41)
  Top 0.203: v102.62,29.26 102.21,29.67 93.47,29.67 91.64,31.5 RN3.5
  Bottom 0.203: v102.62,29.26 108.92,22.96 OK2.3
N$52  (via drill 0.41)
  Top 0.203: v119.69,28.04 117.65,30.07 95.5,30.07 94.08,31.5 RN3.6
  Bottom 0.203: v119.69,28.04 125.78,28.04 OK3.1
N$53
  Bottom 0.203: OK3.3 125.98,22.76 127.41,21.34 127.41,13.01 124.56,10.16 124.56,9.96 123.34,8.74 96.32,8.74 96.32,16.26 97.33,17.27 97.33,28.04 96.72,28.65 96.72,31.5 RN3.7
N$54  (via drill 0.41)
  Top 0.203: v138.79,28.04 137.77,29.06 121.51,29.06 120.09,30.48 100.18,30.48 99.16,31.5 RN3.8
  Bottom 0.203: v138.79,28.04 142.85,28.04 OK4.1
N$55  (via drill 0.41)
  Top 0.203: v137.97,31.09 137.77,31.29 102.01,31.29 101.8,31.5 RN3.9
  Bottom 0.203: v137.97,31.09 137.97,27.84 142.85,22.96 OK4.3
O1
  Top 0.203: K1.S2 108.92,57.71 107.7,56.49 102.82,56.49 102.41,56.08 LED9.K
O2
  Top 0.203: K2.S2 120.9,57.71 119.69,56.49 114.81,56.49 114.4,56.08 LED10.K
O3
  Top 0.203: K3.S2 132.89,57.71 131.67,56.49 126.8,56.49 126.39,56.08 LED11.K
O4
  Top 0.203: K4.S2 144.88,57.71 143.66,56.49 138.79,56.49 138.38,56.08 LED12.K
O5
  Top 0.203: K5.S2 108.92,39.62 107.9,38.61 102.82,38.61 102.41,38.2 LED13.K
O6
  Top 0.203: K6.S2 120.9,39.62 119.89,38.61 114.81,38.61 114.4,38.2 LED14.K
O7
  Top 0.203: K7.S2 132.89,39.62 131.88,38.61 126.8,38.61 126.39,38.2 LED15.K
O8
  Top 0.203: K8.S2 144.88,39.62 143.87,38.61 138.79,38.61 138.38,38.2 LED16.K
RES
  Top 0.203: RESETA.1 13.21,11.58 14.22,12.6 18.9,12.6 19.51,11.99 26.82,11.99 32.72,17.88 GND.RES
SLIDER_IN  (via drill 0.41)
  Top 0.203: v56.49,37.19 57.91,38.61 71.12,38.61 72.54,40.03 88.39,40.03 91.64,43.28 SERIAL.5
  Bottom 0.203: v56.49,37.19 56.49,30.89 53.65,28.04 53.65,21.13 50.6,18.09 GND.A0

## Text on the board
_tsilk: SCL SDA
_bsilk: SKAARHOJ 2013 | PCB-TLY-JACK-MEGA v12-13